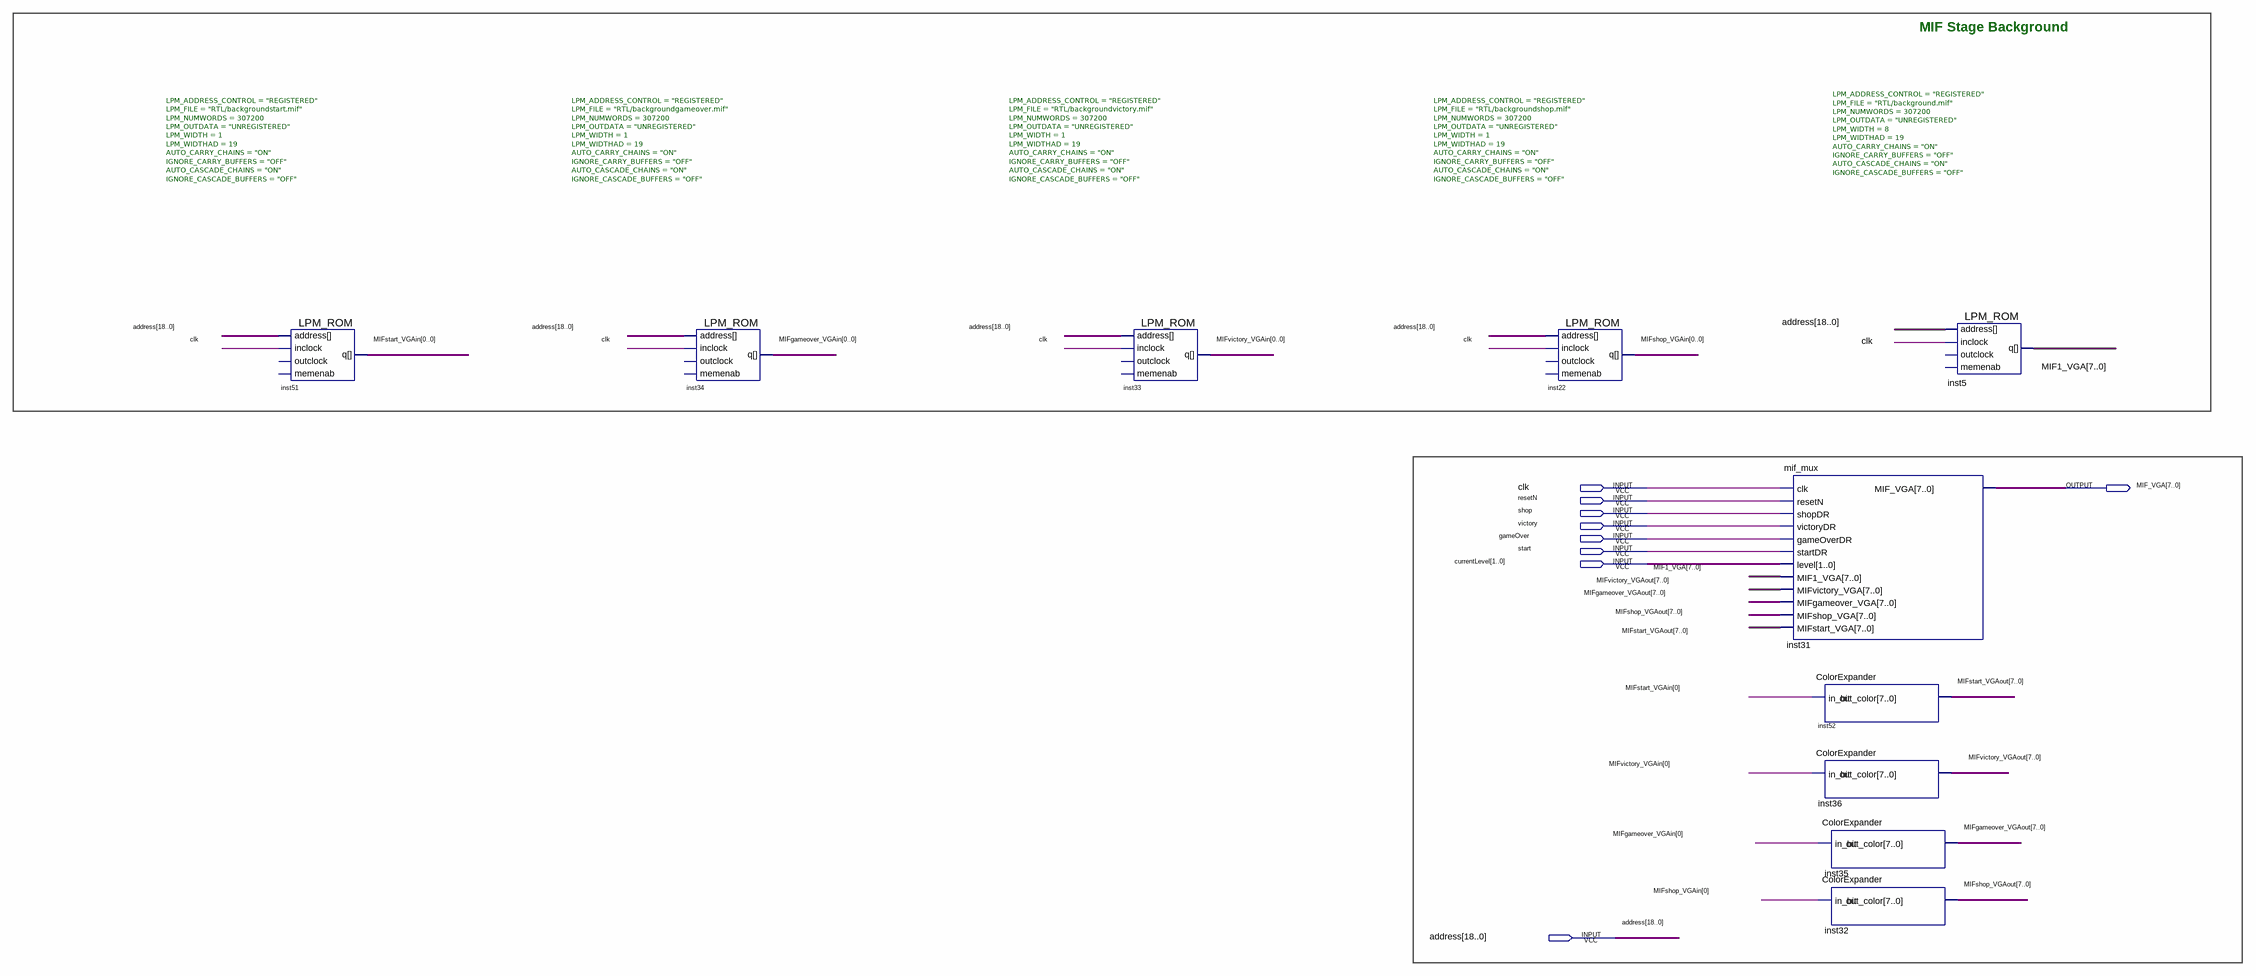
[diagram p0: schematic sheet]
// Quartus schematic Mif_Mux_Top.bdf as structural Verilog: 10 symbols, 9 pins
module Mif_Mux_Top (
  input  clk,
  input  resetN,
  input  shop,
  input  victory,
  input  gameOver,
  input  start,
  input  [1:0] currentLevel,
  input  [18:0] address,
  output [7:0] MIF_VGA
);

  wire [0:0] MIFgameover_VGAin, MIFshop_VGAin, MIFstart_VGAin, MIFvictory_VGAin;
  wire [7:0] MIF1_VGA, MIFgameover_VGAout, MIFshop_VGAout, MIFstart_VGAout, MIFvictory_VGAout;

  LPM_ROM #(.LPM_ADDRESS_CONTROL("REGISTERED"), .LPM_FILE("RTL/backgroundstart.mif"), .LPM_NUMWORDS(307200), .LPM_OUTDATA("UNREGISTERED"), .LPM_WIDTH(1), .LPM_WIDTHAD(19), .AUTO_CARRY_CHAINS("ON"), .IGNORE_CARRY_BUFFERS("OFF"), .AUTO_CASCADE_CHAINS("ON"), .IGNORE_CASCADE_BUFFERS("OFF")) inst51 (
    .address(address), .inclock(clk), .q(MIFstart_VGAin[0]));  // open: outclock, memenab
  LPM_ROM #(.LPM_ADDRESS_CONTROL("REGISTERED"), .LPM_FILE("RTL/backgroundgameover.mif"), .LPM_NUMWORDS(307200), .LPM_OUTDATA("UNREGISTERED"), .LPM_WIDTH(1), .LPM_WIDTHAD(19), .AUTO_CARRY_CHAINS("ON"), .IGNORE_CARRY_BUFFERS("OFF"), .AUTO_CASCADE_CHAINS("ON"), .IGNORE_CASCADE_BUFFERS("OFF")) inst34 (
    .address(address), .inclock(clk), .q(MIFgameover_VGAin[0]));  // open: outclock, memenab
  LPM_ROM #(.LPM_ADDRESS_CONTROL("REGISTERED"), .LPM_FILE("RTL/backgroundvictory.mif"), .LPM_NUMWORDS(307200), .LPM_OUTDATA("UNREGISTERED"), .LPM_WIDTH(1), .LPM_WIDTHAD(19), .AUTO_CARRY_CHAINS("ON"), .IGNORE_CARRY_BUFFERS("OFF"), .AUTO_CASCADE_CHAINS("ON"), .IGNORE_CASCADE_BUFFERS("OFF")) inst33 (
    .address(address), .inclock(clk), .q(MIFvictory_VGAin[0]));  // open: outclock, memenab
  LPM_ROM #(.LPM_ADDRESS_CONTROL("REGISTERED"), .LPM_FILE("RTL/backgroundshop.mif"), .LPM_NUMWORDS(307200), .LPM_OUTDATA("UNREGISTERED"), .LPM_WIDTH(1), .LPM_WIDTHAD(19), .AUTO_CARRY_CHAINS("ON"), .IGNORE_CARRY_BUFFERS("OFF"), .AUTO_CASCADE_CHAINS("ON"), .IGNORE_CASCADE_BUFFERS("OFF")) inst22 (
    .address(address), .inclock(clk), .q(MIFshop_VGAin[0]));  // open: outclock, memenab
  mif_mux inst31 (
    .clk(clk), .resetN(resetN), .shopDR(shop), .victoryDR(victory), .gameOverDR(gameOver), .startDR(start),
    .level(currentLevel), .MIF1_VGA(MIF1_VGA), .MIFvictory_VGA(MIFvictory_VGAout),
    .MIFgameover_VGA(MIFgameover_VGAout), .MIFshop_VGA(MIFshop_VGAout), .MIFstart_VGA(MIFstart_VGAout),
    .MIF_VGA(MIF_VGA));
  ColorExpander inst52 (.in_bit(MIFstart_VGAin[0]), .out_color(MIFstart_VGAout));
  ColorExpander inst36 (.in_bit(MIFvictory_VGAin[0]), .out_color(MIFvictory_VGAout));
  ColorExpander inst35 (.in_bit(MIFgameover_VGAin[0]), .out_color(MIFgameover_VGAout));
  ColorExpander inst32 (.in_bit(MIFshop_VGAin[0]), .out_color(MIFshop_VGAout));
  LPM_ROM #(.LPM_ADDRESS_CONTROL("REGISTERED"), .LPM_FILE("RTL/background.mif"), .LPM_NUMWORDS(307200), .LPM_OUTDATA("UNREGISTERED"), .LPM_WIDTH(8), .LPM_WIDTHAD(19), .AUTO_CARRY_CHAINS("ON"), .IGNORE_CARRY_BUFFERS("OFF"), .AUTO_CASCADE_CHAINS("ON"), .IGNORE_CASCADE_BUFFERS("OFF")) inst5 (
    .address(address), .inclock(clk), .q(MIF1_VGA));  // open: outclock, memenab

  // Notes on the sheet:
  //   MIF Stage Background
endmodule
